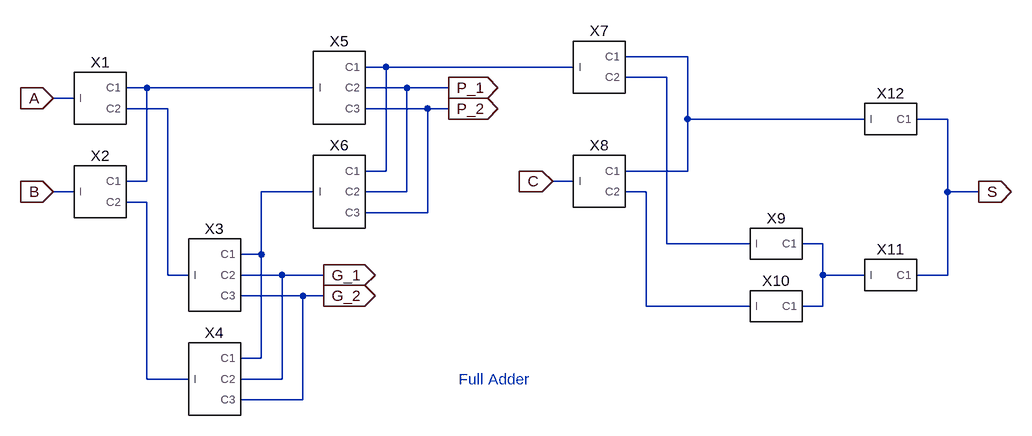
[diagram p0: schematic fag2p2.asc]
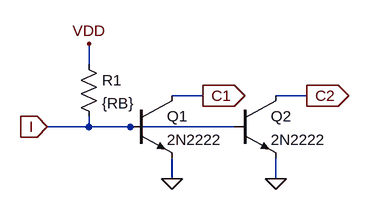
[diagram p1: sub-circuit iilg2.asc]
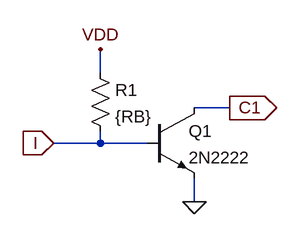
[diagram p2: sub-circuit iilg1.asc]
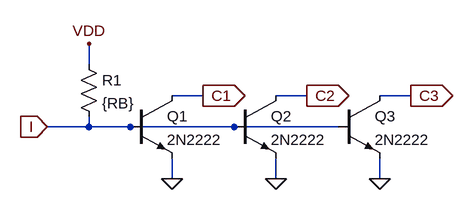
[diagram p3: sub-circuit iilg3.asc]
fag2p2.asc, the LTspice schematic file:
Version 4
SHEET 1 4164 944
WIRE 1264 -304 1168 -304
WIRE 800 -288 768 -288
WIRE 1088 -288 800 -288
WIRE 1232 -272 1168 -272
WIRE 432 -256 400 -256
WIRE 688 -256 432 -256
WIRE 832 -256 768 -256
WIRE 896 -256 832 -256
WIRE 320 -240 288 -240
WIRE 464 -224 400 -224
WIRE 864 -224 768 -224
WIRE 896 -224 864 -224
WIRE 1264 -208 1264 -304
WIRE 1536 -208 1264 -208
WIRE 1664 -208 1616 -208
WIRE 800 -128 800 -288
WIRE 800 -128 768 -128
WIRE 1264 -128 1264 -208
WIRE 1264 -128 1168 -128
WIRE 432 -112 432 -256
WIRE 432 -112 400 -112
WIRE 1088 -112 1056 -112
WIRE 320 -96 288 -96
WIRE 688 -96 608 -96
WIRE 832 -96 832 -256
WIRE 832 -96 768 -96
WIRE 1200 -96 1168 -96
WIRE 1664 -96 1664 -208
WIRE 1712 -96 1664 -96
WIRE 432 -80 400 -80
WIRE 864 -64 864 -224
WIRE 864 -64 768 -64
WIRE 1232 -16 1232 -272
WIRE 1360 -16 1232 -16
WIRE 1472 -16 1440 -16
WIRE 608 0 608 -96
WIRE 608 0 576 0
WIRE 464 32 464 -224
WIRE 496 32 464 32
WIRE 640 32 576 32
WIRE 704 32 640 32
WIRE 1472 32 1472 -16
WIRE 1536 32 1472 32
WIRE 1664 32 1664 -96
WIRE 1664 32 1616 32
WIRE 672 64 576 64
WIRE 704 64 672 64
WIRE 1200 80 1200 -96
WIRE 1360 80 1200 80
WIRE 1472 80 1472 32
WIRE 1472 80 1440 80
WIRE 608 160 608 0
WIRE 608 160 576 160
WIRE 432 192 432 -80
WIRE 496 192 432 192
WIRE 640 192 640 32
WIRE 640 192 576 192
WIRE 672 224 672 64
WIRE 672 224 576 224
FLAG 288 -240 A
IOPIN 288 -240 In
FLAG 288 -96 B
IOPIN 288 -96 In
FLAG 1056 -112 C
IOPIN 1056 -112 In
FLAG 704 32 G_1
IOPIN 704 32 Out
FLAG 896 -256 P_1
IOPIN 896 -256 Out
FLAG 1712 -96 S
IOPIN 1712 -96 Out
FLAG 704 64 G_2
IOPIN 704 64 Out
FLAG 896 -224 P_2
IOPIN 896 -224 Out
SYMBOL iilg2 352 -240 R0
SYMATTR InstName X1
SYMBOL iilg2 352 -96 R0
SYMATTR InstName X2
SYMBOL iilg2 1120 -288 R0
SYMATTR InstName X7
SYMBOL iilg1 1392 -16 R0
SYMATTR InstName X9
SYMBOL iilg1 1392 80 R0
SYMATTR InstName X10
SYMBOL iilg1 1568 32 R0
SYMATTR InstName X11
SYMBOL iilg1 1568 -208 R0
SYMATTR InstName X12
SYMBOL iilg2 1120 -112 R0
SYMATTR InstName X8
SYMBOL iilg3 528 32 R0
SYMATTR InstName X3
SYMBOL iilg3 528 192 R0
SYMATTR InstName X4
SYMBOL iilg3 720 -256 R0
SYMATTR InstName X5
SYMBOL iilg3 720 -96 R0
SYMATTR InstName X6
TEXT 912 192 Left 2 ;Full Adder

iilg2.asc, the sub-circuit schematic file:
Version 4
SHEET 1 880 680
WIRE 384 240 384 208
WIRE 560 288 512 288
WIRE 720 288 672 288
WIRE 384 336 384 320
WIRE 384 336 320 336
WIRE 448 336 384 336
WIRE 608 336 448 336
WIRE 512 416 512 384
WIRE 672 416 672 384
FLAG 384 208 VDD
FLAG 320 336 I
IOPIN 320 336 In
FLAG 512 416 0
FLAG 560 288 C1
IOPIN 560 288 Out
FLAG 672 416 0
FLAG 720 288 C2
IOPIN 720 288 Out
SYMBOL npn 448 288 R0
SYMATTR InstName Q1
SYMATTR Value 2N2222
SYMBOL res 368 224 R0
SYMATTR InstName R1
SYMATTR Value {RB}
SYMBOL npn 608 288 R0
SYMATTR InstName Q2
SYMATTR Value 2N2222

iilg1.asc, the sub-circuit schematic file:
Version 4
SHEET 1 880 680
WIRE 384 240 384 208
WIRE 560 288 512 288
WIRE 384 336 384 320
WIRE 384 336 320 336
WIRE 448 336 384 336
WIRE 512 416 512 384
FLAG 512 416 0
FLAG 384 208 VDD
FLAG 320 336 I
IOPIN 320 336 In
FLAG 560 288 C1
IOPIN 560 288 Out
SYMBOL npn 448 288 R0
SYMATTR InstName Q1
SYMATTR Value 2N2222
SYMBOL res 368 224 R0
SYMATTR InstName R1
SYMATTR Value {RB}

iilg3.asc, the sub-circuit schematic file:
Version 4
SHEET 1 956 680
WIRE 384 240 384 208
WIRE 560 288 512 288
WIRE 720 288 672 288
WIRE 880 288 832 288
WIRE 384 336 384 320
WIRE 384 336 320 336
WIRE 448 336 384 336
WIRE 608 336 448 336
WIRE 768 336 608 336
WIRE 512 416 512 384
WIRE 672 416 672 384
WIRE 832 416 832 384
FLAG 384 208 VDD
FLAG 320 336 I
IOPIN 320 336 In
FLAG 512 416 0
FLAG 560 288 C1
IOPIN 560 288 Out
FLAG 672 416 0
FLAG 720 288 C2
IOPIN 720 288 Out
FLAG 832 416 0
FLAG 880 288 C3
IOPIN 880 288 Out
SYMBOL npn 448 288 R0
SYMATTR InstName Q1
SYMATTR Value 2N2222
SYMBOL res 368 224 R0
SYMATTR InstName R1
SYMATTR Value {RB}
SYMBOL npn 608 288 R0
SYMATTR InstName Q2
SYMATTR Value 2N2222
SYMBOL npn 768 288 R0
SYMATTR InstName Q3
SYMATTR Value 2N2222

The netlist it stands for:
* fag2p2.asc
XX1 A N004 N005 iilg2
XX2 B N004 N008 iilg2
XX7 N002 N001 N003 iilg2
XX9 N003 N009 iilg1
XX10 N007 N009 iilg1
XX11 N009 S iilg1
XX12 N001 S iilg1
XX8 C N001 N007 iilg2
XX3 N005 N006 G_1 G_2 iilg3
XX4 N008 N006 G_1 G_2 iilg3
XX5 N004 N002 P_1 P_2 iilg3
XX6 N006 N002 P_1 P_2 iilg3

* block symbol definitions
.subckt iilg2 I C1 C2
Q1 C1 I 0 0 2N2222
R1 VDD I {RB}
Q2 C2 I 0 0 2N2222
.ends iilg2

.subckt iilg1 I C1
Q1 C1 I 0 0 2N2222
R1 VDD I {RB}
.ends iilg1

.subckt iilg3 I C1 C2 C3
Q1 C1 I 0 0 2N2222
R1 VDD I {RB}
Q2 C2 I 0 0 2N2222
Q3 C3 I 0 0 2N2222
.ends iilg3

.model NPN NPN
.model PNP PNP
.lib standard.bjt
* Full Adder
.backanno
.end